# EasyEDA schematic AVS.json

## Sheets
1 CONTROLLER BOARD: TITLE: AUTOMATIC SPEED CONTROL AND ACCIDENT AVOIDANCE OF VEHICAL USING MULTI SENSOR; REV: 1.0; Date: 2021-06-05; Sheet: 1/1; Drawn By: Atul Dighe; Company: SAI SOLUTIONS
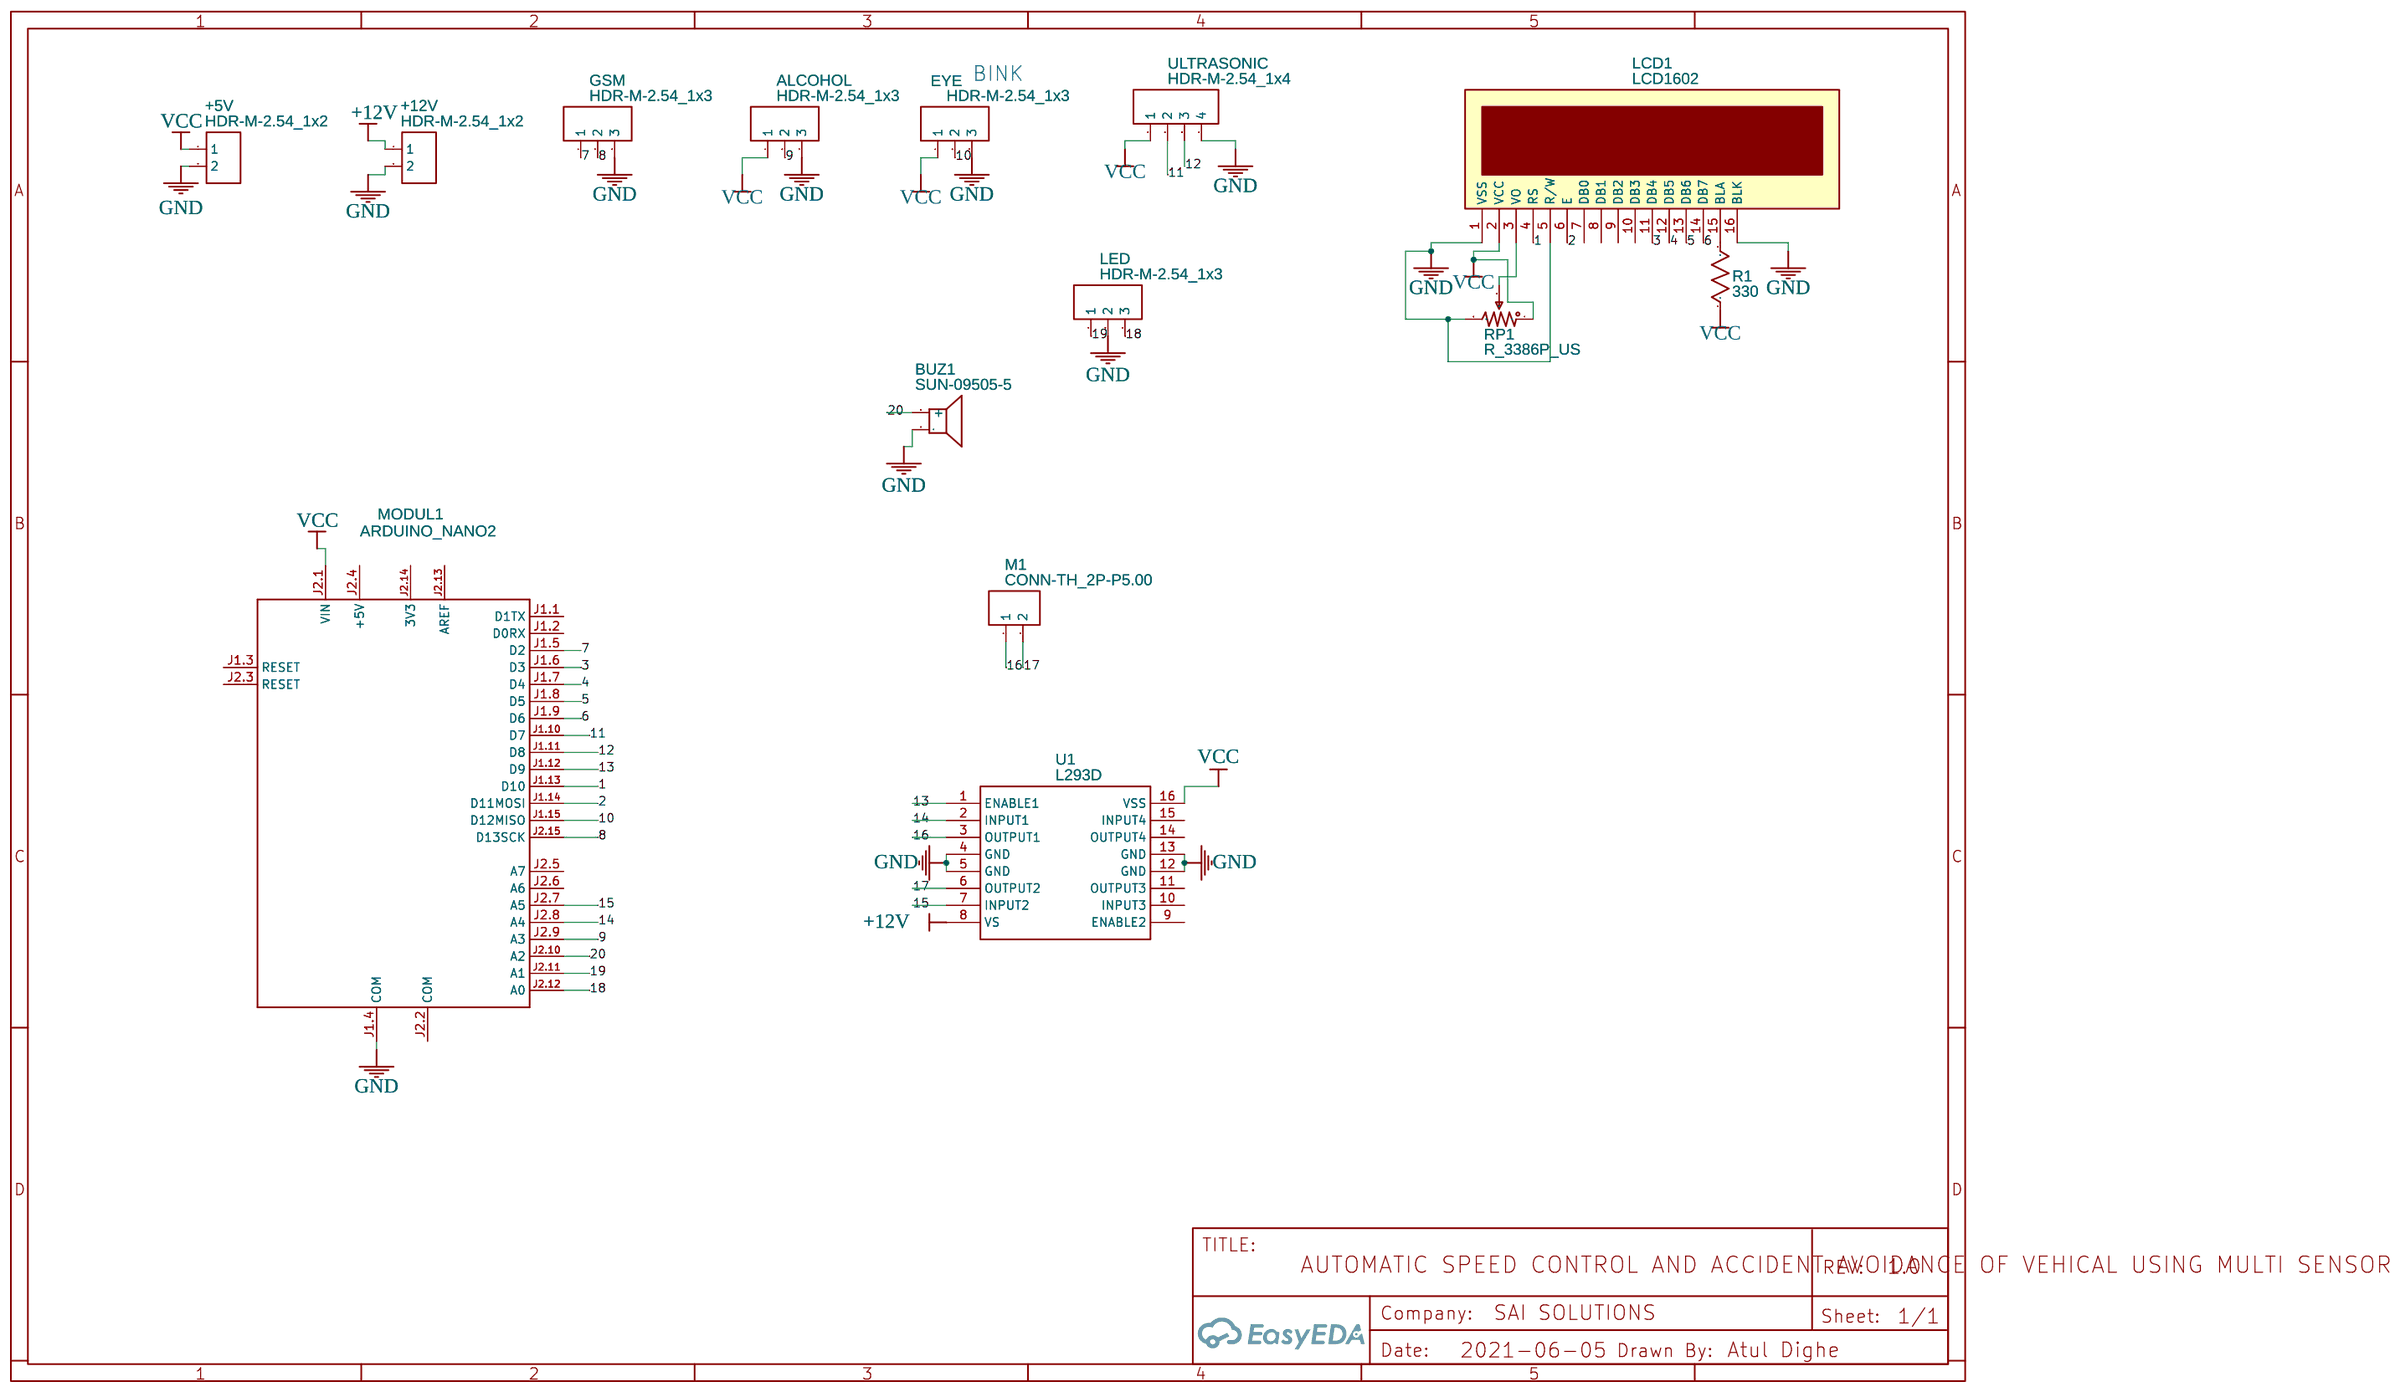
[diagram p0: CONTROLLER BOARD]
2 LED INTERFACE: TITLE: LED INTERFACE; Company: SAI SOLUTION
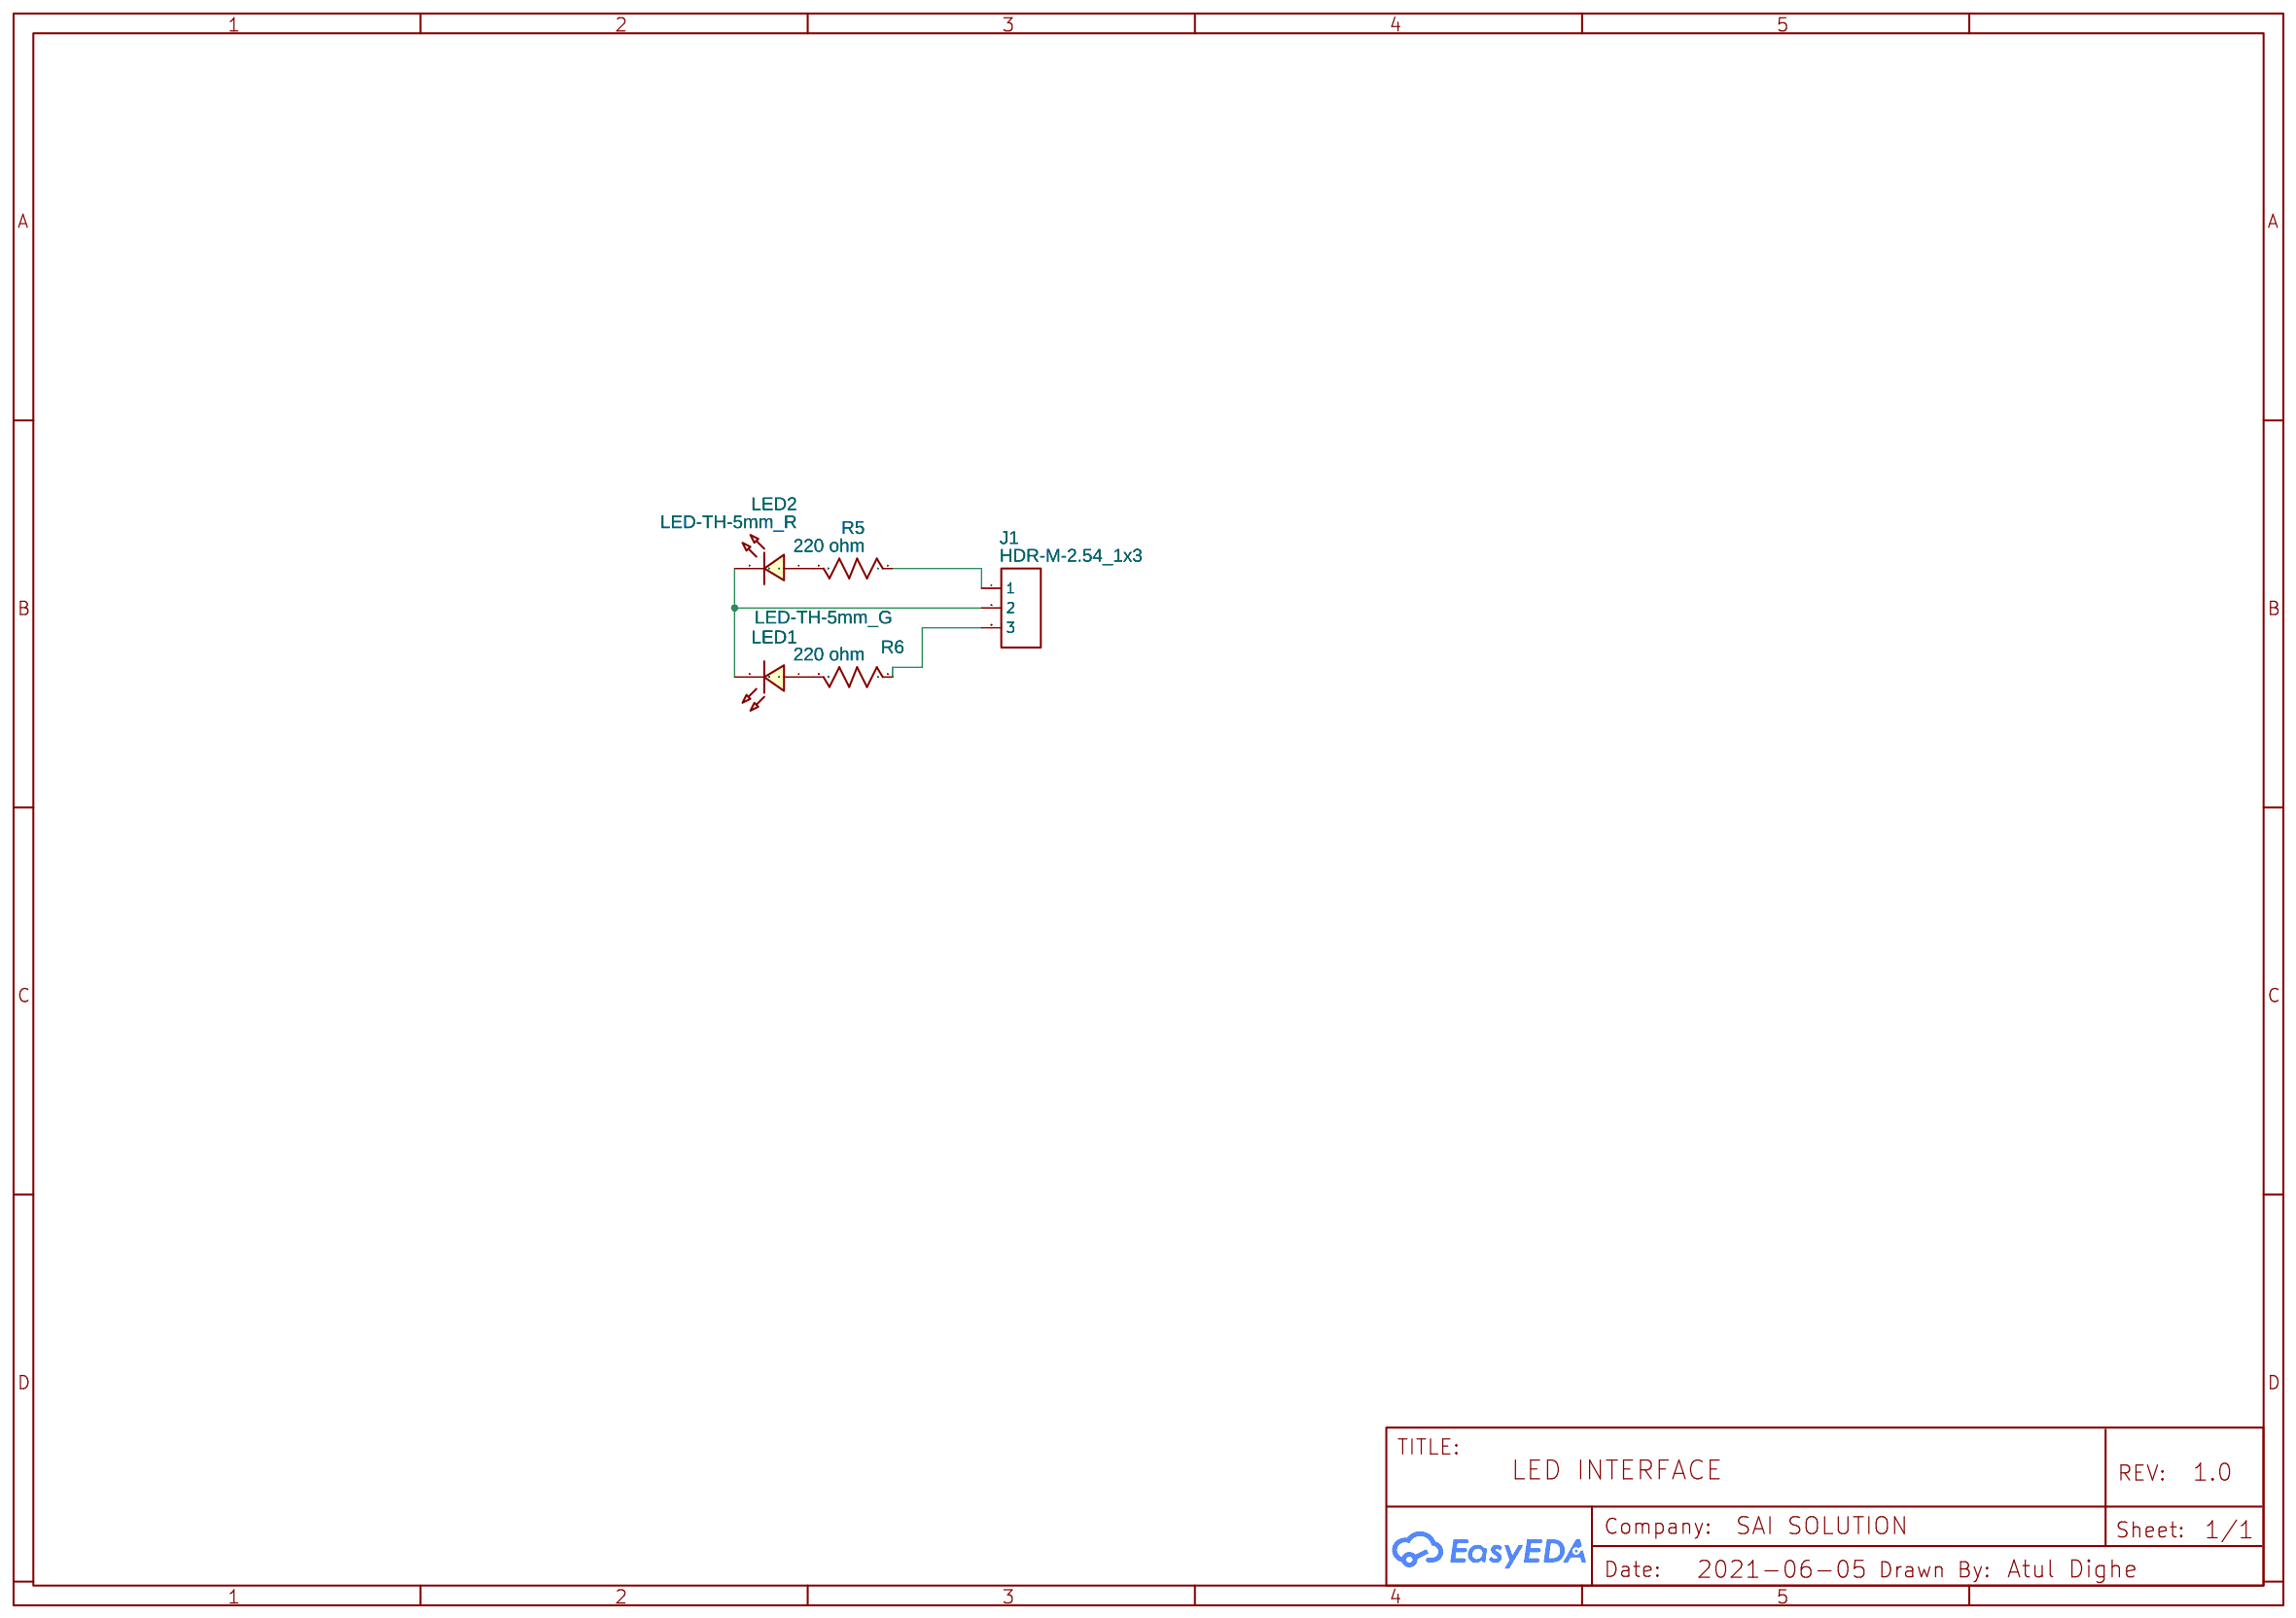
[diagram p1: LED INTERFACE]

## Parts
sheet CONTROLLER BOARD
+5V  HDR-M-2.54_1x2  [HDR-M-2.54_1X2]
+12V  HDR-M-2.54_1x2  [HDR-M-2.54_1X2]
ALCOHOL  HDR-M-2.54_1x3  [HDR-M-2.54_1X3]
BUZ1  SUN-09505-5  [BUZ-TH_BD9.6-P5.00-D0.7-FD]
EYE  HDR-M-2.54_1x3  [HDR-M-2.54_1X3]
GSM  HDR-M-2.54_1x3  [HDR-M-2.54_1X3]
LCD1  LCD1602  [LCD1602]
LED  HDR-M-2.54_1x3  [HDR-M-2.54_1X3]
M1  CONN-TH_2P-P5.00  [CONN-TH_2P-P5.00]
MODUL1  ARDUINO_NANO2  [ARDUINO_NANO2]
R1  330  [R_AXIAL-0.4]
RP1  R_3386P_US  [RES-ADJ-TH_3386P]
U1  L293D  [DIP-16_L20.0-W6.4-P2.54-LS7.6-BL]
ULTRASONIC  HDR-M-2.54_1x4  [HDR-M-2.54_1X4]
sheet LED INTERFACE
J1  HDR-M-2.54_1x3  [HDR-M-2.54_1X3]
LED1  LED-TH-5mm_G  [LED-TH_BD5.0_GREEN]
LED2  LED-TH-5mm_R  [LED-TH_BD5.0_RED]
R5  220 ohm  [R_AXIAL-0.4]
R6  220 ohm  [R_AXIAL-0.4]

## Library data of the parts
+5V +12V = HDR-M-2.54_1x2: Supplier Part: C124375; Supplier: LCSC; Contributor: LCEDA_Lib
ALCOHOL EYE GSM J1 LED = HDR-M-2.54_1x3: Supplier Part: C180248; Supplier: LCSC; Contributor: LCEDA_Lib
BUZ1 = SUN-09505-5: Supplier Part: C2862; Supplier: LCSC; Manufacturer: ReliaPro; image: http://image.lceda.cn/szlcsc/C2862.jpg
LCD1 = LCD1602: Manufacturer: LONTECH(厦门龙特); Manufacturer Part: LCM1602K-NSW-BBW; Supplier Part: C83275; Supplier: LCSC; Contributor: LCEDA_Lib
M1 = CONN-TH_2P-P5.00: Supplier: LCSC; Contributor: LCEDA_Lib
MODUL1 = ARDUINO_NANO2
R1 R5 R6 = R_AXIAL-0.4_US: Contributor: LCEDA_Lib
RP1 = R_3386P_US: Supplier: LCSC; Contributor: LCEDA_Lib; value(Ω): 10K
U1 = L293D: Contributor: pitreluc; Supplier: LCSC; Manufacturer: STMicroelectronics; Supplier Part: C12340; JLCPCB Part Class: Extended Part
ULTRASONIC = HDR-M-2.54_1x4: Supplier Part: C124378; Supplier: LCSC; Contributor: LCEDA_Lib
LED1 = LED-TH-5mm_G: Manufacturer: EVERLIGHT(台湾亿光); Manufacturer Part: 333-2SYGD/S530-E2; Supplier Part: C88163; Supplier: LCSC; Contributor: LCEDA_Lib
LED2 = LED-TH-5mm_R: Manufacturer: EVERLIGHT(台湾亿光); Manufacturer Part: 333-2SURD/S530-A3; Supplier Part: C87271; Supplier: LCSC; Contributor: LCEDA_Lib

## Nets
+12V: +12V.1 U1.8(VS)
GND: +5V.2 +12V.2 ALCOHOL.3 BUZ1.2 EYE.3 GSM.3 LCD1.1(VSS) LCD1.5(R/W) LCD1.16(BLK) LED.2 MODUL1.J1.4(COM) RP1.3 U1.4(GND) U1.5(GND) U1.12(GND) U1.13(GND) ULTRASONIC.4
VCC: +5V.1 ALCOHOL.1 EYE.1 LCD1.2(VCC) MODUL1.J2.1(VIN) R1.1 RP1.1 U1.16(VSS) ULTRASONIC.1
1: LCD1.4(RS) MODUL1.J1.13(D10)
2: LCD1.6(E) MODUL1.J1.14(D11MOSI)
3: LCD1.11(DB4) MODUL1.J1.6(D3)
4: LCD1.12(DB5) MODUL1.J1.7(D4)
5: LCD1.13(DB6) MODUL1.J1.8(D5)
6: LCD1.14(DB7) MODUL1.J1.9(D6)
7: GSM.1 MODUL1.J1.5(D2)
8: GSM.2 MODUL1.J2.15(D13SCK)
9: ALCOHOL.2 MODUL1.J2.9(A3)
10: EYE.2 MODUL1.J1.15(D12MISO)
11: MODUL1.J1.10(D7) ULTRASONIC.2
12: MODUL1.J1.11(D8) ULTRASONIC.3
13: MODUL1.J1.12(D9) U1.1(ENABLE1)
14: MODUL1.J2.8(A4) U1.2(INPUT1)
15: MODUL1.J2.7(A5) U1.7(INPUT2)
16: M1.1 U1.3(OUTPUT1)
17: M1.2 U1.6(OUTPUT2)
18: LED.3 MODUL1.J2.12(A0)
19: LED.1 MODUL1.J2.11(A1)
20: BUZ1.1(+) MODUL1.J2.10(A2)
Net-(J1-1): J1.1 R5.1
Net-(J1-2): J1.2 LED1.2 LED2.2
Net-(J1-3): J1.3 R6.1
Net-(LCD1-3): LCD1.3(VO) RP1.2
Net-(LCD1-15): LCD1.15(BLA) R1.2
Net-(LED1-1): LED1.1 R6.2
Net-(LED2-1): LED2.1 R5.2

Not connected (* = marked no-connect by the designer): LCD1 7(DB0) 8(DB1) 9(DB2) 10(DB3); MODUL1 J1.1(D1TX) J1.2(D0RX) J1.3(RESET) J2.2(COM) J2.3(RESET) J2.4(+5V) J2.5(A7) J2.6(A6) J2.13(AREF) J2.14(3V3); U1 9(ENABLE2) 10(INPUT3) 11(OUTPUT3) 14(OUTPUT4) 15(INPUT4)

## Notes on the sheets
sheet 1
- BINK
